# Altium schematic sheet BMI270-Accelerometer-Gyroscope.SchDoc: BMI270-Accelero-Gyro
size A4
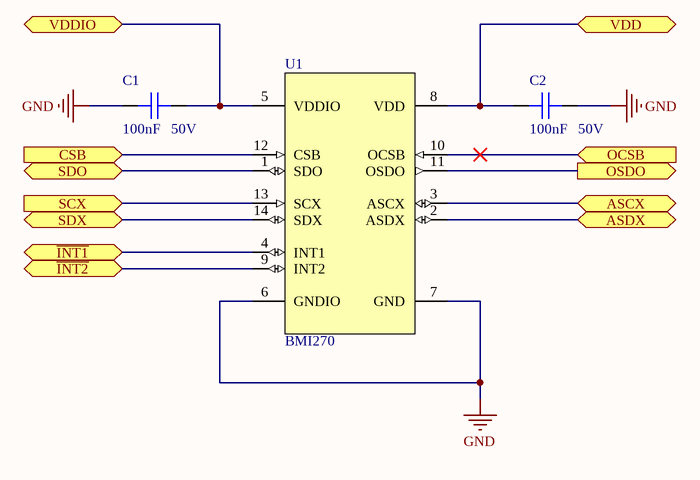
[diagram p0: BMI270-Accelerometer-Gyroscope.SchDoc]

## Parts
C1  Capacitance: 100nF  Voltage: 50V  [C0402]  (hidden comment: CAP CER 0.1UF 50V X7R 0402)
C2  Capacitance: 100nF  Voltage: 50V  [C0402]  (hidden comment: CAP CER 0.1UF 50V X7R 0402)
U1  BMI270  [XDCR_BMI270]

## Ports
ASCX (bidir), ASDX (bidir), CSB (in), OCSB (in), OSDO (out), SCX (in), SDO (bidir), SDX (bidir), VDD, VDDIO, ~{INT1} (bidir), ~{INT2} (bidir)

## Nets
GND: C1.1 C2.2 U1.6(GNDIO) U1.7(GND)
~{INT1}: U1.4(INT1) ; port ~{INT1}
~{INT2}: U1.9(INT2) ; port ~{INT2}
ASCX: U1.3(ASCX) ; port ASCX
ASDX: U1.2(ASDX) ; port ASDX
CSB: U1.12(CSB) ; port CSB
OCSB: U1.10(OCSB) ; port OCSB
OSDO: U1.11(OSDO) ; port OSDO
SCX: U1.13(SCX) ; port SCX
SDO: U1.1(SDO) ; port SDO
SDX: U1.14(SDX) ; port SDX
VDD: C2.1 U1.8(VDD) ; port VDD
VDDIO: C1.2 U1.5(VDDIO) ; port VDDIO

## Notes on the sheet
- Title
- Size:
- Date:
- A4
- Number:
- Time:
- Revision:
- Sheet
- of
- File:

## Library data of the parts
C1 C2 = CAP CER 0.1UF 50V X7R 0402: 0.1µF ±10% 50V Ceramic Capacitor X7R 0402 (1005 Metric); Manufacturer Part Number: CGA2B3X7R1H104K050BB; Manufacturer: TDK; Supplier 1: Digi-Key; Stock 1: 2925303; Pricing 1: 1=0.17, 10=0.118, 50=0.0668, 100=0.0553, 500=0.0388, 1000=0.0321, 2500=0.0299, 5000=0.0273 (USD); Mount: Surface Mount; Case Code (Metric): 1005; Case Code (Imperial): 0402; Min Operating Temperature: -55°C; Max Operating Temperature: 125°C; Tolerance: 10%; Dielectric: X7R; Voltage Rating: 50V; Voltage Rating (DC): 50V; Packaging: Tape and Reel; Package Quantity: 1; Termination: SMD/SMT; Composition: Ceramic; Length: 1mm; Height: 0.5mm; Width: 0.02inch; Thickness: 0.022inch; Depth: 0.5mm; REACH SVHC: No SVHC; Lead Free: Lead Free; ComponentLink1URL: http://product.tdk.com/capacitor/mlcc/en/documents/mlccspec_automotive_general_midvoltage_en.pdf?src-supplier=Future+Electronics; ComponentLink1Description: http://product.tdk.com/capacitor/mlcc/en/documents/mlccspec_automotive_general_midvoltage_en.pdf?src-supplier=Future+Electronics; ComponentLink2URL: http://www.farnell.com/datasheets/1807242.pdf?src-supplier=Element14; ComponentLink2Description: http://www.farnell.com/datasheets/1807242.pdf?src-supplier=Element14; ComponentLink3URL: http://www.mouser.com/ds/2/400/lcc_automotive_general_en-843974.pdf?src-supplier=Mouser; ComponentLink3Description: http://www.mouser.com/ds/2/400/lcc_automotive_general_en-843974.pdf?src-supplier=Mouser; ComponentLink4URL: http://www.farnell.com/datasheets/1936565.pdf?src-supplier=Element14; ComponentLink4Description: http://www.farnell.com/datasheets/1936565.pdf?src-supplier=Element14; ComponentLink5URL: http://www.farnell.com/datasheets/1735392.pdf?src-supplier=Element14; ComponentLink5Description: http://www.farnell.com/datasheets/1735392.pdf?src-supplier=Element14; Supplier Part Number 1: 445-6899-1-ND; Case/Package: 0402; Weight: 2.3E-05oz; Ratings: AEC-Q200
U1 = IC BMI270 IMU ACCEL/GYRO I2C/SPI 14LGA: Accelerometer, Gyroscope, 6 Axis Sensor I²C, SPI Output; Manufacturer: Bosch Sensortec; Supplier 1: Digi-Key; Manufacturer Part Number: BMI270; Stock 1: 0; Pricing 1: 1=5.75, 5=5.07, 10=4.478, 25=3.6336, 50=3.211, 100=3.1265, 500=2.6195, 1000=2.4505 (USD); Supplier Part Number 1: 828-1091-1-ND